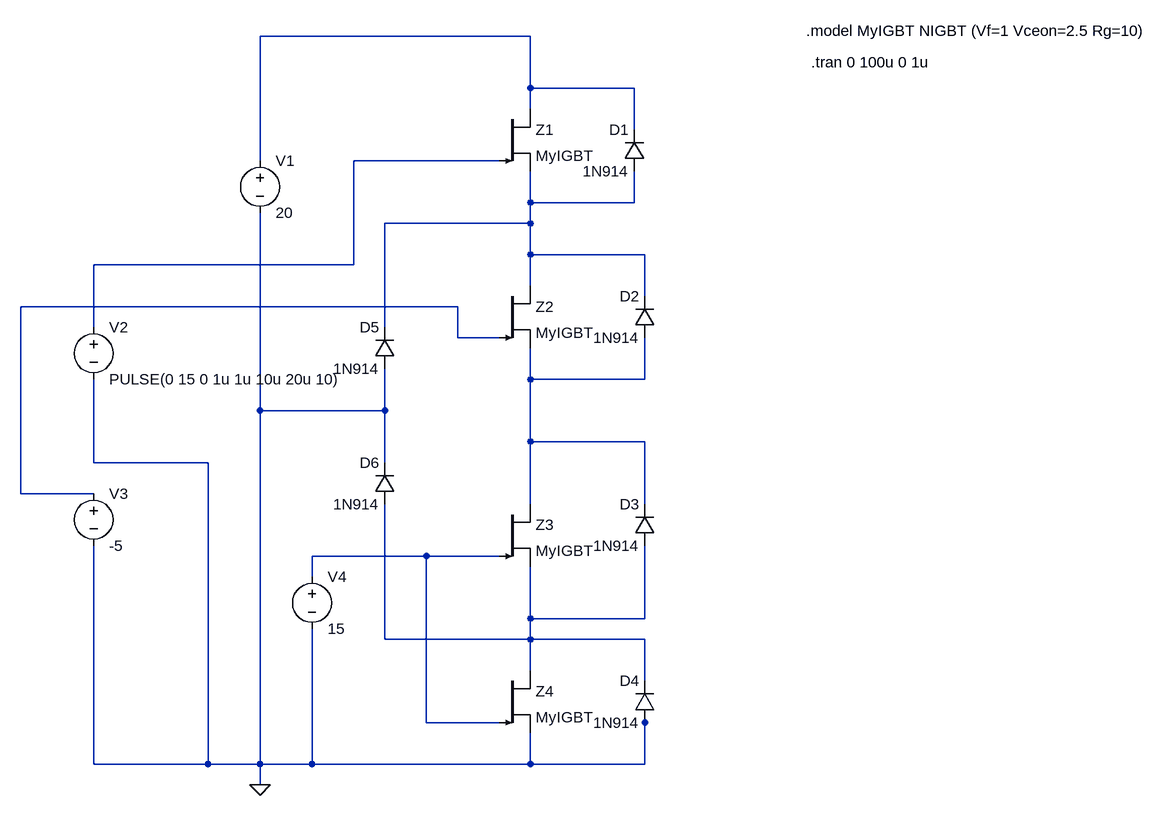
[diagram p0: schematic NPCI.asc]
NPCI.asc, the LTspice schematic file:
Version 4
SHEET 1 1084 976
WIRE 144 -192 -272 -192
WIRE 144 -112 144 -192
WIRE 304 -112 144 -112
WIRE 144 -80 144 -112
WIRE 304 -48 304 -112
WIRE -272 0 -272 -192
WIRE 96 0 -128 0
WIRE 144 64 144 16
WIRE 304 64 304 16
WIRE 304 64 144 64
WIRE 144 96 144 64
WIRE 144 96 -80 96
WIRE 144 144 144 96
WIRE 320 144 144 144
WIRE -128 160 -128 0
WIRE -128 160 -528 160
WIRE 144 192 144 144
WIRE 320 208 320 144
WIRE 32 224 -640 224
WIRE -528 256 -528 160
WIRE -80 256 -80 96
WIRE 32 272 32 224
WIRE 96 272 32 272
WIRE 144 336 144 288
WIRE 320 336 320 272
WIRE 320 336 144 336
WIRE -272 384 -272 80
WIRE -80 384 -80 320
WIRE -80 384 -272 384
WIRE 144 432 144 336
WIRE 320 432 144 432
WIRE -528 464 -528 336
WIRE -352 464 -528 464
WIRE -80 464 -80 384
WIRE -640 512 -640 224
WIRE -528 512 -640 512
WIRE 144 528 144 432
WIRE 320 528 320 432
WIRE -16 608 -192 608
WIRE 96 608 -16 608
WIRE -192 640 -192 608
WIRE 144 704 144 624
WIRE 320 704 320 592
WIRE 320 704 144 704
WIRE -80 736 -80 528
WIRE 144 736 144 704
WIRE 144 736 -80 736
WIRE 320 736 144 736
WIRE 144 784 144 736
WIRE 320 800 320 736
WIRE -16 864 -16 608
WIRE 96 864 -16 864
WIRE 320 864 320 848
WIRE -528 928 -528 592
WIRE -352 928 -352 464
WIRE -352 928 -528 928
WIRE -272 928 -272 384
WIRE -272 928 -352 928
WIRE -192 928 -192 720
WIRE -192 928 -272 928
WIRE 144 928 144 880
WIRE 144 928 -192 928
WIRE 320 928 320 864
WIRE 320 928 144 928
WIRE -272 960 -272 928
FLAG -272 960 0
SYMBOL Misc/NIGBT 96 -80 R0
SYMATTR InstName Z1
SYMATTR Value MyIGBT
SYMBOL diode 320 16 R180
WINDOW 0 24 64 Left 2
WINDOW 3 24 0 Left 2
SYMATTR InstName D1
SYMATTR Value 1N914
SYMBOL diode 336 272 R180
WINDOW 0 24 64 Left 2
WINDOW 3 24 0 Left 2
SYMATTR InstName D2
SYMATTR Value 1N914
SYMBOL Voltage -272 -16 R0
SYMATTR InstName V1
SYMATTR Value 20
SYMBOL Misc/NIGBT 96 192 R0
SYMATTR InstName Z2
SYMATTR Value MyIGBT
SYMBOL Misc/NIGBT 96 528 R0
SYMATTR InstName Z3
SYMATTR Value MyIGBT
SYMBOL Misc/NIGBT 96 784 R0
SYMATTR InstName Z4
SYMATTR Value MyIGBT
SYMBOL diode 336 592 R180
WINDOW 0 24 64 Left 2
WINDOW 3 24 0 Left 2
SYMATTR InstName D3
SYMATTR Value 1N914
SYMBOL diode 336 864 R180
WINDOW 0 24 64 Left 2
WINDOW 3 24 0 Left 2
SYMATTR InstName D4
SYMATTR Value 1N914
SYMBOL diode -64 320 R180
WINDOW 0 24 64 Left 2
WINDOW 3 24 0 Left 2
SYMATTR InstName D5
SYMATTR Value 1N914
SYMBOL diode -64 528 R180
WINDOW 0 24 64 Left 2
WINDOW 3 24 0 Left 2
SYMATTR InstName D6
SYMATTR Value 1N914
SYMBOL voltage -528 240 R0
SYMATTR InstName V2
SYMATTR Value PULSE(0 15 0 1u 1u 10u 20u 10)
SYMBOL voltage -528 496 R0
SYMATTR InstName V3
SYMATTR Value -5
SYMBOL voltage -192 624 R0
SYMATTR InstName V4
SYMATTR Value 15
TEXT 568 -200 Left 2 !.model MyIGBT NIGBT (Vf=1 Vceon=2.5 Rg=10)
TEXT 576 -152 Left 2 !.tran 0 100u 0 1u

The netlist it stands for:
* NPCI.asc
Z1 N001 N002 N003 MyIGBT
D1 N003 N001 1N914
D2 N005 N003 1N914
V1 N001 0 20
Z2 N003 N004 N005 MyIGBT
Z3 N005 N006 N007 MyIGBT
Z4 N007 N006 0 MyIGBT
D3 N007 N005 1N914
D4 0 N007 1N914
D5 0 N003 1N914
D6 N007 0 1N914
V2 N002 0 PULSE(0 15 0 1u 1u 10u 20u 10)
V3 N004 0 -5
V4 N006 0 15
.model D D
.lib standard.dio
.model MyIGBT NIGBT (Vf=1 Vceon=2.5 Rg=10)
.tran 0 100u 0 1u
.backanno
.end